# EasyEDA Pro project YTMR4040_3电阻开发板100x100mm_1028打板.eprj, board PCB1
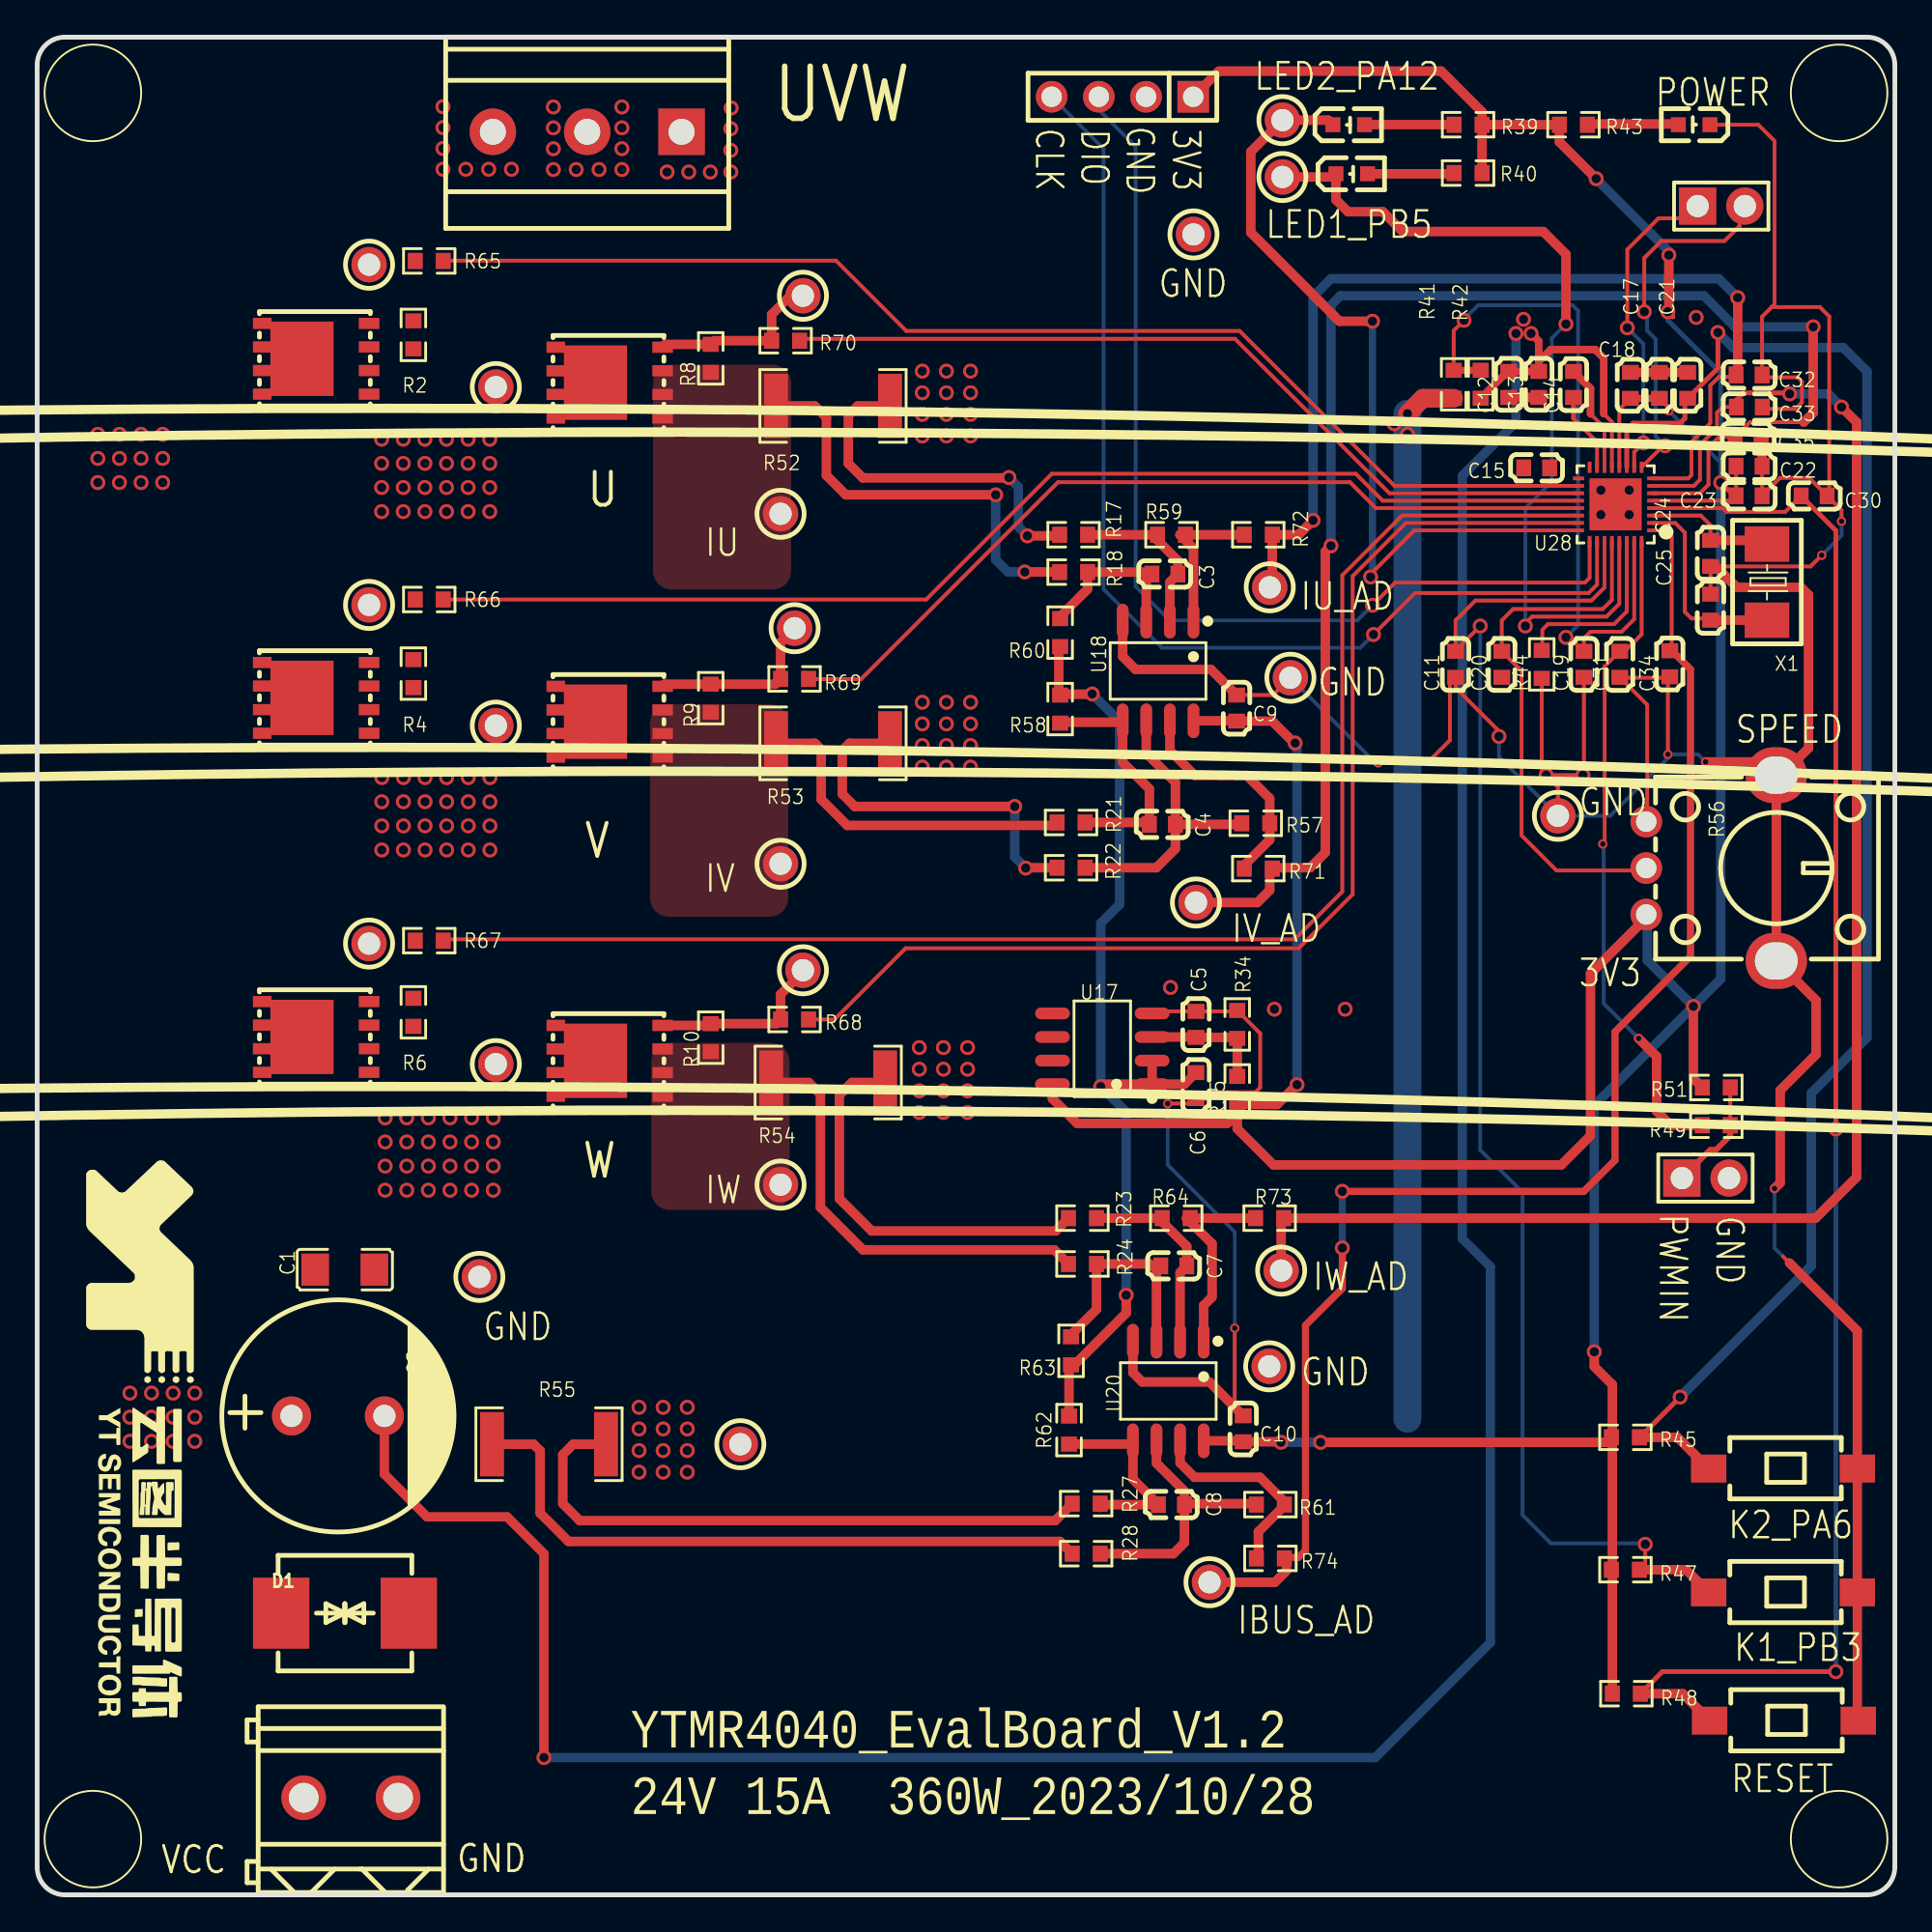
[diagram p1: board, top side]
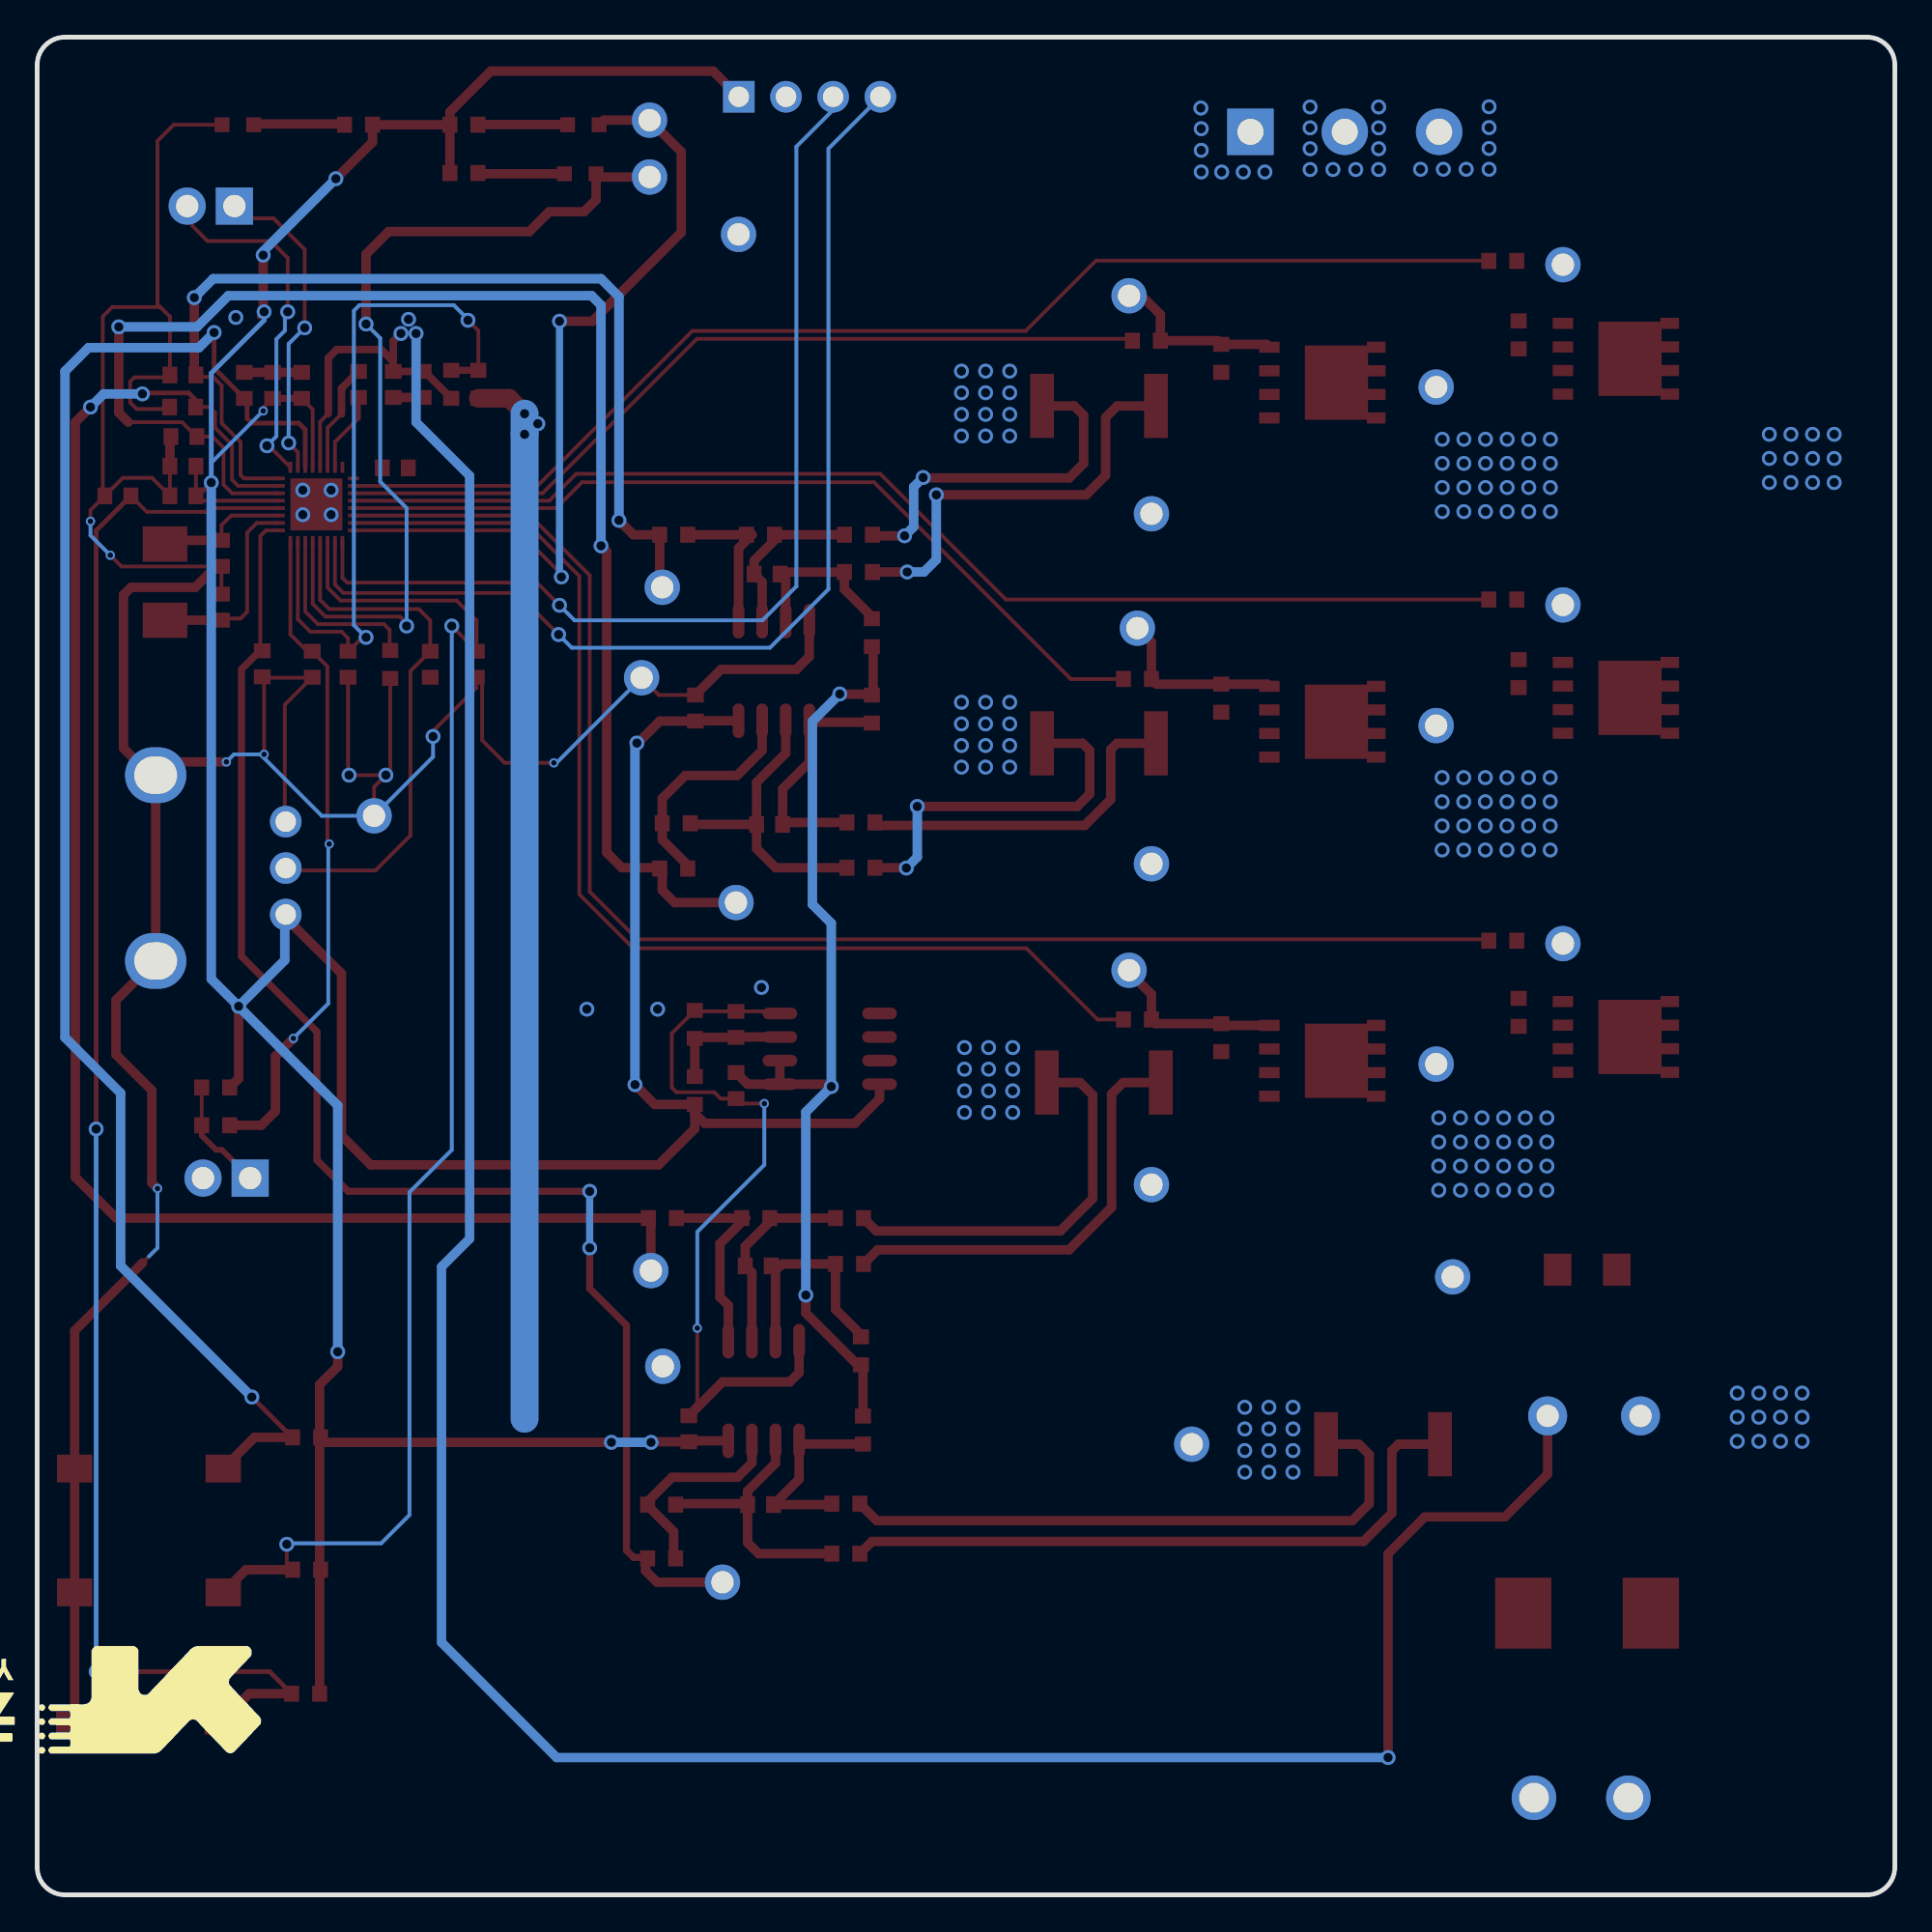
[diagram p2: board, bottom side, seen from below]

Outline 100 x 100 mm; copper layers: Top Layer, Bottom Layer. Coordinates in mm from the lower left corner of the outline.
Outline path: 0,98.5 0,1.5 arc(0.44,0.44) 1.5,0 98.5,0 arc(99.56,0.44) 100,1.5 100,98.5 arc(99.56,99.56) 98.5,100 1.5,100 arc(0.44,99.56) 0,98.5
Stack: Top Layer 0.035mm / Dielectric1 1.51mm FR4 er 4.5 / Bottom Layer 0.035mm

## Design rules (mm)
template: 自定义配置
spacing copperThickness1oz (default): track to track 0.102, other pairs 0.152 to 0.3
spacing copperThickness2oz: track to track 0.203, other pairs 0.152 to 0.3
track width copperThickness1oz (default): min 0.127, default 0.254, max 2.54
track width copperThickness2oz: min 0.203, default 0.254, max 2.54
differential pair differentialPair (default): width min 0.127, default 0.254, max 2.54; gap min 0.152, default 0.152
via viaSize (default): diameter min 0.5, default 0.61, max 10; hole min 0.3, default 0.305, max 6.3

## Placement (name value [footprint] x y rotation side)
C1  100nF  [C1206]  16.56 33.66 0 top
C2  1000uF  [CAP-TH_BD12.5-P5.00-D0.6-FD]  16.19 25.78 0 top
C3  100pF  [C0603]  60.71 71.1 0 top
C4  100pF  [C0603]  60.57 57.62 0 top
C5  100nF  [C0603]  62.38 46.86 90 top
C6  100nF  [C0603]  62.38 43.56 270 top
C7  100pF  [C0603]  61.19 33.86 0 top
C8  100pF  [C0603]  61.06 21.01 0 top
C9  100nF  [C0603]  64.57 63.89 90 top
C10  100nF  [C0603]  64.92 25.09 90 top
C11  100nF  [C0603]  76.36 66.24 90 top
C12  100nF  [C0603]  79.22 81.31 270 top
C13  10uF  [C0603]  80.83 81.31 270 top
C14  100nF  [C0603]  82.7 81.31 90 top
C15  1uF  [C0603]  80.72 76.81 0 top
C17  100nF  [C0603]  87.32 81.25 270 top
C18  10uF  [C0603]  85.76 81.25 270 top
C19  100nF  [C0603]  83.26 66.24 90 top
C20  100nF  [C0603]  78.84 66.24 90 top
C21  100nF  [C0603]  88.85 81.25 270 top
C22  4.7uF  [C0603]  92.15 76.91 180 top
C23  100nF  [C0603]  92.15 75.31 180 top
C24  20pF  [C0603]  90.07 72.21 270 top
C25  20pF  [C0603]  90.08 69.32 90 top
C30  100nF  [C0603]  95.66 75.31 180 top
C31  100pF  [C0603]  85.19 66.24 90 top
C32  15nF  [C0603]  92.15 81.81 180 top
C33  15nF  [C0603]  92.17 80.09 0 top
C34  15nF  [C0603]  87.88 66.27 90 top
C35  15nF  [C0603]  92.1 78.5 180 top
D1  SMCJ30CA  [SMC_L6.9-W5.9-LS7.9-BI]  16.57 15.16 180 top
H1  X6511WV-04H-C60D30  [HDR-TH_4P-P2.54-V-M]  58.42 96.79 180 top
H2  PZ254V-11-02P  [HDR-TH_2P-P2.54-V-M]  90.65 90.91 0 top
H3  PZ254V-11-02P  [HDR-TH_2P-P2.54-V-M]  89.8 38.58 0 top
LED1  KT-0603白灯  [LED0603-R-RD_WHITE]  70.6 95.29 0 top
LED2  KT-0603白灯  [LED0603-R-RD_WHITE]  70.76 92.64 0 top
LED3  KT-0603白灯  [LED0603-R-RD_WHITE]  89.2 95.29 180 top
Q1  VSP003N04MST-G  [DFN-8_L5.8-W4.9-P1.27-LS6.1-BL]  14.99 82.69 90 top
Q2  VSP003N04MST-G  [DFN-8_L5.8-W4.9-P1.27-LS6.1-BL]  14.99 64.44 90 top
Q3  VSP003N04MST-G  [DFN-8_L5.8-W4.9-P1.27-LS6.1-BL]  14.99 46.18 90 top
Q4  VSP003N04MST-G  [DFN-8_L5.8-W4.9-P1.27-LS6.1-BL]  30.79 81.4 90 top
Q5  VSP003N04MST-G  [DFN-8_L5.8-W4.9-P1.27-LS6.1-BL]  30.79 63.15 90 top
Q6  VSP003N04MST-G  [DFN-8_L5.8-W4.9-P1.27-LS6.1-BL]  30.79 44.9 90 top
R2  12kΩ  [R0603]  20.25 83.97 90 top
R4  12kΩ  [R0603]  20.25 65.74 90 top
R6  12kΩ  [R0603]  20.25 47.5 90 top
R8  12kΩ  [R0603]  36.26 82.71 90 top
R9  12kΩ  [R0603]  36.26 64.42 90 top
R10  12kΩ  [R0603]  36.26 46.14 90 top
R17  3kΩ  [R0603]  55.79 73.22 0 top
R18  3kΩ  [R0603]  55.79 71.2 0 top
R21  3kΩ  [R0603]  55.66 57.73 0 top
R22  3kΩ  [R0603]  55.66 55.29 0 top
R23  1kΩ  [R0603]  56.27 36.43 0 top
R24  1kΩ  [R0603]  56.27 33.96 0 top
R27  3kΩ  [R0603]  56.47 21.06 0 top
R28  3kΩ  [R0603]  56.47 18.36 0 top
R34  12kΩ  [R0603]  64.6 46.86 270 top
R35  12kΩ  [R0603]  64.6 43.3 270 top
R39  3kΩ  [R0603]  77.03 95.29 0 top
R40  3kΩ  [R0603]  77.03 92.69 0 top
R41  51kΩ  [R0603]  76.25 81.31 270 top
R42  3kΩ  [R0603]  77.71 81.31 90 top
R43  3kΩ  [R0603]  82.7 95.29 180 top
R44  0Ω  [R0603]  80.99 66.23 270 top
R45  12kΩ  [R0603]  85.5 24.63 180 top
R47  12kΩ  [R0603]  85.5 17.5 180 top
R48  12kΩ  [R0603]  85.55 10.83 180 top
R49  1kΩ  [R0603]  90.39 41.43 180 top
R51  12kΩ  [R0603]  90.39 43.46 180 top
R52  5mΩ  [R2512]  42.84 80.15 180 top
R53  5mΩ  [R2512]  42.84 61.99 180 top
R54  5mΩ  [R2512]  42.58 43.73 180 top
R55  5mΩ  [R2512]  27.55 24.26 0 top
R56  10kΩ  [RES-TH_RK09K1130A70]  90.12 55.27 270 top
R57  24kΩ  [R0603]  65.6 57.68 0 top
R58  24kΩ  [R0603]  55.07 63.83 270 top
R59  24kΩ  [R0603]  61.06 73.22 0 top
R60  24kΩ  [R0603]  55.07 67.94 90 top
R61  24kΩ  [R0603]  66.39 21.01 0 top
R62  24kΩ  [R0603]  55.55 25.02 270 top
R63  24kΩ  [R0603]  55.66 29.29 270 top
R64  24kΩ  [R0603]  61.32 36.43 0 top
R65  4.7Ω  [R0603]  21.11 87.95 180 top
R66  4.7Ω  [R0603]  21.11 69.73 180 top
R67  4.7Ω  [R0603]  21.11 51.36 180 top
R68  4.7Ω  [R0603]  40.77 47.12 180 top
R69  4.7Ω  [R0603]  40.77 65.45 180 top
R70  4.7Ω  [R0603]  40.29 83.66 180 top
R71  100Ω  [R0603]  65.73 55.25 0 top
R72  100Ω  [R0603]  65.73 73.22 0 top
R73  100Ω  [R0603]  66.34 36.43 0 top
R74  100Ω  [R0603]  66.39 18.11 0 top
SW2  TS-1101-C-W  [SW-SMD_L6.0-W3.3-LS8.0]  93.98 22.95 180 top
SW3  TS-1101-C-W  [SW-SMD_L6.0-W3.3-LS8.0]  93.98 16.28 180 top
SW4  TS-1101-C-W  [SW-SMD_L6.0-W3.3-LS8.0]  94.03 9.38 180 top
U1  RH-5000  [TEST-TH_BD2.54-P1.4_RED]  17.87 87.75 0 top
U2  RH-5000  [TEST-TH_BD2.54-P1.4_RED]  17.87 69.44 180 top
U3  RH-5000  [TEST-TH_BD2.54-P1.4_RED]  17.87 51.21 180 top
U4  DB128L-5.08-2P-GN-S  [CONN-TH_2P-P5.08_DB128L-5.08-2P]  16.89 5.23 0 top
U5  RH-5000  [TEST-TH_BD2.54-P1.4_RED]  24.69 81.16 90 top
U6  RH-5000  [TEST-TH_BD2.54-P1.4_RED]  24.69 62.94 90 top
U7  RH-5000  [TEST-TH_BD2.54-P1.4_RED]  24.69 44.72 90 top
U8  RH-5000  [TEST-TH_BD2.54-P1.4_RED]  23.8 33.26 0 top
U9  XY128V-A-5.08-3P  [CONN-TH_XY128V-A-5.08-3P]  29.61 94.91 180 top
U10  RH-5000  [TEST-TH_BD2.54-P1.4_RED]  41.22 86.08 180 top
U11  RH-5000  [TEST-TH_BD2.54-P1.4_RED]  40.02 74.34 0 top
U12  RH-5000  [TEST-TH_BD2.54-P1.4_RED]  40.02 55.5 0 top
U13  RH-5000  [TEST-TH_BD2.54-P1.4_RED]  40.02 38.23 0 top
U14  RH-5000  [TEST-TH_BD2.54-P1.4_RED]  37.85 24.26 0 top
U15  RH-5000  [TEST-TH_BD2.54-P1.4_RED]  40.77 68.18 180 top
U16  RH-5000  [TEST-TH_BD2.54-P1.4_RED]  41.22 49.77 0 top
U17  RS822XK  [SOP-8_L4.9-W3.9-P1.27-LS6.0-BL]  57.34 45.54 90 top
U18  RS822XK  [SOP-8_L4.9-W3.9-P1.27-LS6.0-BL]  60.34 65.88 180 top
U19  RH-5000  [TEST-TH_BD2.54-P1.4_RED]  62.38 53.42 0 top
U20  RS822XK  [SOP-8_L4.9-W3.9-P1.27-LS6.0-BL]  60.89 27.12 180 top
U21  RH-5000  [TEST-TH_BD2.54-P1.4_RED]  66.35 70.39 180 top
U22  RH-5000  [TEST-TH_BD2.54-P1.4_RED]  63.11 16.83 0 top
U23  RH-5000  [TEST-TH_BD2.54-P1.4_RED]  67.46 65.52 0 top
U24  RH-5000  [TEST-TH_BD2.54-P1.4_RED]  66.97 33.6 0 top
U25  RH-5000  [TEST-TH_BD2.54-P1.4_RED]  66.32 28.45 0 top
U26  RH-5000  [TEST-TH_BD2.54-P1.4_RED]  81.86 58.08 0 top
U28  -  [QFN-32_L4.0-W4.0-P0.40-BL-EP2.7]  84.97 74.85 90 top
U29  RH-5000  [TEST-TH_BD2.54-P1.4_RED]  67.03 92.47 0 top
U30  RH-5000  [TEST-TH_BD2.54-P1.4_RED]  67.03 95.53 0 top
U31  RH-5000  [TEST-TH_BD2.54-P1.4_RED]  62.24 89.38 0 top
X1  8MHz  [CRYSTAL-SMD_L5.0-W3.2]  93.12 70.67 90 top

## Footprints (pads in the part's own frame, mm; a bottom-side part is the same pattern mirrored in y, then rotated)
C0603
  rect 0.8x0.9 smd: 1(-0.7,0) 2(0.7,0)
C1206
  rect 1.485x1.728 smd: 1(-1.593,0) 2(1.593,0)
CAP-TH_BD12.5-P5.00-D0.6-FD
  round 2.1 hole 1.2: 1(-2.5,0) 2(2.5,0)
CONN-TH_2P-P5.08_DB128L-5.08-2P
  round 2.4 hole 1.6: 1(-2.54,0) 2(2.54,0)
CONN-TH_XY128V-A-5.08-3P
  rect 2.5x2.5 hole 1.4: 1(-5.08,0)
  round 2.5 hole 1.4: 2(0,0) 3(5.08,0)
CRYSTAL-SMD_L5.0-W3.2
  rect 1.9x2.4 smd: 1(-2.05,0) 2(2.05,0)
DFN-8_L5.8-W4.9-P1.27-LS6.1-BL
  rect 0.6x1.1 smd: 1(-1.905,-2.875) 2(-0.635,-2.875) 3(0.635,-2.875) 4(1.905,-2.875)
  rect 0.6x1 smd: 5(1.905,2.875) 6(0.635,2.875) 7(-0.635,2.875) 8(-1.905,2.875)
  rect 4x3.4 smd: 9(0,0.738)
HDR-TH_2P-P2.54-V-M
  rect 2x2 hole 1.2: 1(-1.27,0)
  round 2 hole 1.2: 2(1.27,0)
HDR-TH_4P-P2.54-V-M
  rect 1.7x1.7 hole 1.1: 1(-3.81,0)
  round 1.7 hole 1.1: 2(-1.27,0) 3(1.27,0) 4(3.81,0)
LED0603-R-RD_WHITE
  rect 0.8x0.8 smd: 1(0.851,0) 2(-0.851,0)
QFN-32_L4.0-W4.0-P0.40-BL-EP2.7
  rect 0.2x0.6 smd: 1(-1.4,-2) 2(-1,-2) 3(-0.6,-2) 4(-0.2,-2) 5(0.2,-2) 6(0.6,-2) 7(1,-2) 8(1.4,-2) 17(1.4,2) 18(1,2) 19(0.6,2) 20(0.2,2) 21(-0.2,2) 22(-0.6,2) 23(-1,2) 24(-1.4,2)
  rect 0.6x0.2 smd: 9(2,-1.4) 10(2,-1) 11(2,-0.6) 12(2,-0.2) 13(2,0.2) 14(2,0.6) 15(2,1) 16(2,1.4) 25(-2,1.4) 26(-2,1) 27(-2,0.6) 28(-2,0.2) 29(-2,-0.2) 30(-2,-0.6) 31(-2,-1) 32(-2,-1.4)
  rect 2.8x2.8 smd: 33(0,0)
R0603
  rect 0.806x0.864 smd: 1(-0.753,0) 2(0.753,0)
R2512
  rect 1.282x3.456 smd: 1(-3.067,0) 2(3.067,0)
RES-TH_RK09K1130A70
  round 1.7 hole 1.1: 1(-2.5,-3.5) 2(0,-3.5) 3(2.5,-3.5)
  oval 3x3.3 hole 2x2.3: 4(5,3.5) 5(-5,3.5)
SMC_L6.9-W5.9-LS7.9-BI
  rect 3.03x3.82 smd: 1(-3.435,0) 2(3.435,0)
SOP-8_L4.9-W3.9-P1.27-LS6.0-BL
  oval 0.63x1.865 smd: 1(-1.905,-2.683) 2(-0.635,-2.683) 3(0.635,-2.683) 4(1.905,-2.683) 5(1.905,2.683) 6(0.635,2.683) 7(-0.635,2.683) 8(-1.905,2.683)
SW-SMD_L6.0-W3.3-LS8.0
  rect 1.9x1.5 smd: 1(-4,0) 2(4,0)
TEST-TH_BD2.54-P1.4_RED
  round 1.9 hole 1.2: 1(0,0)

## Nets
As in the schematic.

Pads without a net: U17 5 6 7

## Via types
v1: diameter 0.8, hole 0.5, Top Layer to Bottom Layer, 231 vias
v2: diameter 0.5, hole 0.3, Top Layer to Bottom Layer, 11 vias

## Routing (per net, layer and track width the routed paths; a pad name or vN(x,y) marks a point on that pad's centre or on a via; arc(x,y) is an arc through that point)
3V3: length 240.7
  Top Layer w0.203: v2(87.83,79.88) 87.83,80.05 87.32,80.56 ; U28.12 85.17,79.96 85.76,80.56 ; U28.5 91.19,75.05 C23.2 C22.2
  Top Layer w0.254: v1(87.78,85.22) 88.05,84.94 ; v1(90.63,76.02) 91.34,75.31 C23.2
  Top Layer w0.381: 85.76,80.56 87.32,80.56
  Top Layer w0.508: R39.2 77.78,95.97 75.58,98.17 63.61,98.17 H1.1 ; R39.2 R40.2 ; R39.2 81.91,95.29 ; v1(66.95,24.36) 66.92,24.39 C10.1 64.87,24.44 U20.8 ; 64.6,42.07 64.6,41.24 66.55,39.29 82.04,39.29 83.62,40.87 83.62,49.59 86.67,52.64 ; 64.6,42.07 R35.2 66.75,42.55 v1(67.82,43.61) ; 64.6,42.07 64.06,41.53 55.98,41.53 54.65,42.86 U17.8 ; v1(83.82,29.24) 83.82,28.44 84.79,27.47 R48.2 ; U18.8 64.55,63.2 C9.1 66.48,63.18 67.67,62 v1(67.72,62) ; R51.2 89.15,43.94 v1(89.15,47.83) ; v1(87.83,88.27) 87.83,85.27 v1(87.78,85.22) ; R43.2 81.95,94.36 v1(83.92,92.38) ; R45.2 84.47,24.36 v1(69.09,24.36)
  Bottom Layer w0.203: v2(87.83,79.88) 90.63,77.09
  Bottom Layer w0.254: v1(87.78,85.22) 87.78,84.76 90.63,81.92 v1(90.63,76.02)
  Bottom Layer w0.508: v1(83.82,29.24) 83.82,42.49 v1(89.15,47.83) ; 86.67,52.64 86.67,50.31 v1(89.15,47.83) ; v1(67.82,43.61) 67.82,61.9 v1(67.72,62) ; v1(87.83,88.27) 87.83,88.47 v1(83.92,92.38) ; v1(89.15,47.83) 90.63,49.3 v1(90.63,76.02) ; v1(69.09,24.36) v1(66.95,24.36)
AGND: length 451.7
  Top Layer w0.203: C22.1 C23.1 93.82,76.28 95.39,76.28 C30.1 ; v2(96.06,72.11) 95.46,71.51 90.08,71.51 ; v2(97.13,73.94) 97.13,74.53 C30.1 ; U26.1 81.86,59.64 v1(81.23,60.27) ; C30.1 96.47,75.42 96.47,84.96 95.96,85.47 93.37,85.47 ; 93.98,34.37 94.32,34.02 ; 86.67,57.64 86.67,64.06 C31.1 ; 92.85,80.09 92.96,79.98 94.64,79.98 95,80.34 95,81.46 94.77,81.69 92.85,81.69 92.85,84.95 93.37,85.47 ; 87.95,65.52 87.78,65.34 v2(87.78,61.39) ; 87.95,65.52 88.01,65.57 ; 87.95,65.52 85.63,65.52 ; U17.4 60.13,47.56 C5.2 64.55,47.56 64.6,47.61 65.84,46.37 65.84,43.46 65.58,43.21 63.55,43.21 63.21,42.86 C6.2 62.11,42.6 v2(60.86,42.6) ; v1(78.69,62.36) 78.69,62.64 76.36,64.98 76.36,65.57 76.05,65.26 76.05,62.15 74.83,60.94 v2(72.19,60.94) ; 93.37,85.47 93.52,85.62 93.52,94.41 92.65,95.29 LED3.2 ; U23.1 66.53,64.58 64.57,64.58 ; 90.08,71.51 C25.2 ; 90.08,71.51 C24.2 ; v1(81.23,60.27) 80.99,60.51 80.99,65.46 ; v1(81.23,60.27) v1(83.21,60.27) 83.26,60.33 83.26,65.52 ; 84.33,79.73 84.77,79.29 U28.13 ; v2(64.47,30.51) 64.47,26.25
  Top Layer w0.406: 80.83,82.53 80.83,83.64 v1(80.42,84.05) ; 80.83,82.53 C13.1 C12.1 79.15,82.01 R42.1 ; 80.83,82.53 81.48,83.19 83.87,83.19 84.33,82.73 84.33,79.73
  Top Layer w0.5: C18.1 C17.1 C21.1 ; C2.2 18.69,22.65 20.99,20.35 25.3,20.35 27.28,18.36 v1(27.28,7.39) ; 94.32,34.02 97.98,30.37 SW2.1 SW3.1 97.98,9.43 SW4.1
  Top Layer w0.508: 93.62,60.09 93.67,60.04 95.35,61.72 95.35,69.98 94.94,70.38 91.49,70.38 90.37,71.51 ; 93.62,60.09 92.73,60.99 v2(89.81,60.99) ; 93.62,60.09 R56.4 ; 93.62,60.09 R56.5 ; R28.1 55.05,19.03 28.6,19.03 27.08,20.55 27.08,23.9 26.72,24.26 24.47,24.26 ; 64.57,64.58 63.19,65.96 59.13,65.96 58.43,66.66 U18.4 ; C22.1 92.85,78.5 ; 93.67,50.24 95.76,48.16 95.76,45.24 93.83,43.31 93.83,38.33 v2(93.52,38.02) ; C10.2 64.47,26.25 63.1,27.61 59.49,27.61 58.98,28.11 U20.4
  Bottom Layer w0.203: v2(96.06,72.11) 97.13,73.18 v2(97.13,73.94) ; v1(78.69,62.36) 78.69,61.26 U26.1 84.68,58.08 87.78,61.19 ; v2(89.81,60.99) 89.41,61.39 v2(87.78,61.39) ; v2(60.86,42.6) 60.86,39.29 64.47,35.69 v2(64.47,30.51) ; U23.1 72.04,60.94 v2(72.19,60.94) ; 93.98,34.37 93.52,34.82 v2(93.52,38.02)
  Bottom Layer w0.5: v1(27.28,7.39) 72.03,7.39 78.23,13.59 78.23,33.81 76.72,35.32 76.72,76.39 79.6,79.27 v1(79.6,84.05)
  vias: v1(61.01,48.84) v1(66.6,47.68) v1(70.41,47.68) v1(80.01,84.81) v1(84.18,75.62) v1(84.18,74.3) v1(85.7,75.62) v1(85.7,74.3) v1(89.31,84.91)
VBUS: length 58.5
  Top Layer w0.508: C12.2 C13.2
  Top Layer w1: R41.2 74.59,80.56 v1(73.76,79.73)
  Bottom Layer w1.5: v1(73.76,79.73) v1(73.76,78.62) 73.76,25.63
  vias: v1(3.27,78.62) v1(3.27,77.32) v1(3.27,76.03) v1(4.43,78.62) v1(4.43,77.32) v1(4.43,76.03) v1(4.99,27.01) v1(4.99,25.71) v1(4.99,24.41) v1(5.59,78.62) v1(5.59,77.32) v1(5.59,76.03) v1(6.16,27.01) v1(6.16,25.71) v1(6.16,24.41) v1(6.76,78.62) v1(6.76,77.32) v1(6.76,76.03) v1(7.32,27.01) v1(7.32,25.71) v1(7.32,24.41) v1(8.48,27.01) v1(8.48,25.71) v1(8.48,24.41) v1(73.05,79.19)
DC_AD: length 38.2
  Top Layer w0.203: v1(82.3,67.69) 82.49,67.69 83.26,66.92 83.26,67.64 83.62,68 85.29,68 85.97,68.67 U28.31 ; v1(76.81,84.76) 76.25,84.2 76.25,82.07
  Top Layer w0.381: 77.71,82.07 76.25,82.07
  Bottom Layer w0.203: v1(76.81,84.76) 76.81,84.81 77.57,85.57 82.65,85.57 82.95,85.27 82.95,68.34 v1(82.3,67.69)
HO1: length 66.1
  Top Layer w0.203: U28.18 73.07,75.85 64.73,84.18 46.79,84.18 43,87.97 21.88,87.97 R65.1
HO2: length 64.5
  Top Layer w0.203: U28.20 72.43,75.05 70.98,76.5 54.62,76.5 47.85,69.73 R66.1
HO3: length 80.6
  Top Layer w0.203: R67.1 21.93,51.44 67.69,51.44 70.26,54 70.26,71.03 73.47,74.25 U28.22
IBUS+: length 94.2
  Top Layer w0.508: R23.1 54.83,35.74 44.92,35.74 43.18,37.48 43.18,43.05 43.85,43.73 45.65,43.73 ; R17.1 54.98,73.16 v1(53.31,73.16) ; R22.1 53.23,55.29 v1(53.21,55.27) ; R52.1 44.17,80.15 43.67,79.64 43.67,77.05 44.44,76.27 52.29,76.27 v1(52.31,76.3) ; R53.1 43.72,61.99 43.34,61.6 43.34,59.26 44.01,58.59 v1(52.62,58.59) ; 30.6,24.26 28.86,24.26 28.3,23.7 28.3,21.06 29.21,20.14 54.8,20.14 R27.1
  Bottom Layer w0.508: v1(53.21,55.27) 52.62,55.86 v1(52.62,58.59) ; v1(53.31,73.16) 52.82,73.65 52.82,75.79 v1(52.31,76.3)
  vias: v1(32.4,26.24) v1(32.4,25.08) v1(32.4,23.92) v1(32.4,22.75) v1(33.7,26.24) v1(33.7,25.08) v1(33.7,23.92) v1(33.7,22.75) v1(35,26.24) v1(35,25.08) v1(35,23.92) v1(35,22.75) v1(47.49,45.61) v1(47.49,44.44) v1(47.49,43.28) v1(47.49,42.12) v1(47.65,82.02) v1(47.65,80.86) v1(47.65,79.69) v1(47.65,78.53) v1(47.65,64.2) v1(47.65,63.03) v1(47.65,61.87) v1(47.65,60.71) v1(48.78,45.61) v1(48.78,44.44) v1(48.78,43.28) v1(48.78,42.12) v1(48.95,82.02) v1(48.95,80.86) v1(48.95,79.69) v1(48.95,78.53) v1(48.95,64.2) v1(48.95,63.03) v1(48.95,61.87) v1(48.95,60.71) v1(50.08,45.61) v1(50.08,44.44) v1(50.08,43.28) v1(50.08,42.12) v1(50.24,82.02) v1(50.24,80.86) v1(50.24,79.69) v1(50.24,78.53) v1(50.24,64.2) v1(50.24,63.03) v1(50.24,61.87) v1(50.24,60.71)
IBUS_AD: length 78.7
  Top Layer w0.203: 87.99,66.99 87.99,73.15 87.68,73.45 U28.1 ; 88.04,67 88.01,66.97
  Top Layer w0.381: v1(70.26,34.82) 70.26,32.64 68.28,30.66 68.28,18.54 67.89,18.16 67.24,18.16 ; v1(70.26,37.87) 83.26,37.87 84.94,39.55 84.94,46.46 89,50.52 89,65.97 88.01,66.97 87.99,66.99
  Top Layer w0.508: 67.24,18.16 67.24,17.44 66.63,16.83 U22.1
  Bottom Layer w0.381: v1(70.26,37.87) v1(70.26,34.82)
IU+: length 22.8
  Top Layer w0.508: R18.1 55.03,71.21 v1(53.16,71.21) ; v1(51.6,75.36) 43.53,75.36 42.49,76.41 42.49,79.52 41.86,80.15 R52.2
  Bottom Layer w0.508: v1(51.6,75.36) 51.6,71.88 52.26,71.21 v1(53.16,71.21)
IU_AD: length 54.4
  Top Layer w0.203: U28.8 88.87,76.25 89.05,76.43 89.05,78.21 90.07,79.22 90.07,81.25 90.53,81.71 91.43,81.71 91.45,81.69
  Top Layer w0.508: 91.45,81.69 91.54,81.78 v1(91.54,85.98) ; U21.1 66.49,70.52 R72.2 67.91,73.22 v1(68.68,73.99)
  Bottom Layer w0.508: v1(68.68,73.99) 68.68,86.03 69.65,87 90.53,87 v1(91.54,85.98)
IV+: length 18.6
  Top Layer w0.508: R53.2 41.87,61.99 42.21,61.65 42.21,58.97 43.61,57.57 54.74,57.57 R21.1
IV_AD: length 81.5
  Top Layer w0.203: U28.6 89.51,75.45 89.97,75.91 89.97,77.9 90.56,78.5 91.45,78.5 91.45,78.52 92.2,79.27 95.1,79.27
  Top Layer w0.508: U19.1 65.68,53.42 66.35,54.08 66.35,55.29 68.52,55.29 69.34,56.11 69.34,72.31 v1(69.65,72.62) ; 95.1,79.27 95.61,79.78 v1(95.61,84.4)
  Bottom Layer w0.508: v1(69.65,72.62) 69.65,85.57 70.16,86.08 89.71,86.08 91.39,84.4 v1(95.61,84.4)
IW+: length 23.6
  Top Layer w0.508: R54.2 41.54,43.73 42.16,43.1 42.16,37.01 44.45,34.72 54.76,34.72 R24.1
IW_AD: length 90.9
  Top Layer w0.203: 91.45,80 91.45,80.09 90.74,80.09 90.42,79.78 90.42,78.97 89.51,78.05 89.51,76.17 89.18,75.85 U28.7
  Top Layer w0.254: 91.45,80.09 91.45,80.45 91.85,80.85 94.28,80.85 v1(94.34,80.8)
  Top Layer w0.508: v1(97.13,80.09) 97.94,79.27 97.94,38.63 95.74,36.43 66.97,36.43 U24.1
  Bottom Layer w0.508: v1(97.13,80.09) 96.42,80.8 v1(94.34,80.8)
KEY1: length 76.5
  Top Layer w0.203: U28.27 84.37,70.37 83.67,69.67 77.42,69.67 76.35,68.61 76.35,66.97 ; 76.35,66.97 v1(77.68,68.3) ; 76.35,66.97 76.36,66.97 ; R47.1 86.56,17.81 v1(86.56,18.87)
  Top Layer w0.508: R47.1 88.76,17.5 SW3.2
  Bottom Layer w0.203: v1(86.56,18.87) 86.51,18.92 81.48,18.92 79.96,20.45 79.96,37.82 77.68,40.1 v1(77.68,68.3)
KEY2: length 86.2
  Top Layer w0.254: U28.11 85.57,78.87 85.92,79.22 88.44,79.22 88.7,79.48 88.7,80.25 ; 88.85,80.56 90.47,82.18 v1(90.47,84.1) ; v1(88.44,26.8) 86.28,24.63
  Top Layer w0.508: R45.1 88.3,24.63 SW2.2
  Bottom Layer w0.508: v1(88.44,26.8) 95.5,33.86 95.5,43.16 98.5,46.15 98.5,82.02 97.23,83.29 91.29,83.29 v1(90.47,84.1)
LED1: length 47.9
  Top Layer w0.203: v1(80.11,68.3) 80.11,68.45 80.47,68.81 84.48,68.81 85.17,69.5 U28.29
  Top Layer w0.508: U29.1 69.74,92.47 LED2.2 69.91,91.25 70.56,90.6 72.44,90.6 73.51,89.53 81.08,89.53 82.3,88.32 v1(82.3,84.56)
  Bottom Layer w0.203: v1(80.11,68.3) 80.11,74.65 81.53,76.07 81.53,83.8 v1(82.3,84.56)
LED2: length 44.2
  Top Layer w0.203: U28.24 74.13,73.45 71.78,71.09 v1(71.78,70.94)
  Top Layer w0.508: LED1.2 69.5,95.53 U30.1 65.33,93.83 65.33,89.48 70.1,84.71 v1(71.88,84.71)
  Bottom Layer w0.381: v1(71.78,70.94) 71.88,71.04 v1(71.88,84.71)
LO1: length 45.4
  Top Layer w0.203: U28.19 72.8,75.45 64.48,83.76 41.15,83.76 R70.1
LO2: length 46.8
  Top Layer w0.203: 41.32,65.79 41.66,65.44 44.35,65.44 54.95,76.04 70.67,76.04 72.06,74.65 U28.21
LO3: length 62.5
  Top Layer w0.203: U28.23 73.68,73.85 70.81,70.99 70.81,53.86 67.91,50.96 46.75,50.96 42.92,47.12 R68.1
NRST: length 87.8
  Top Layer w0.203: U28.4 90.73,74.65 90.93,74.45 94.1,74.45 C30.2
  Top Layer w0.254: C30.2 96.82,73.44 v1(96.82,41.22) ; R48.1 87.49,12.01 v1(96.82,12.01)
  Top Layer w0.508: R48.1 88.58,10.83 SW4.2
  Bottom Layer w0.254: v1(96.82,12.01) v1(96.82,41.22)
PWMIN: length 35.7
  Top Layer w0.203: v2(84.28,56.57) 84.38,56.67 84.38,66.13 C31.2 85.46,66.94 86.37,67.85 U28.32
  Top Layer w0.508: R49.2 87.94,41.43 87.17,42.19 87.17,45.14 v2(86.21,46.1)
  Bottom Layer w0.203: v2(84.28,56.57) 84.33,56.52 84.33,47.98 v2(86.21,46.1)
SPEED: length 29.1
  Top Layer w0.203: 86.67,55.14 81.79,55.14 79.91,57.02 79.91,65.88 C20.2 78.84,68.61 79.45,69.22 84.28,69.22 84.77,69.71 U28.28
SWCLK: length 59.3
  Top Layer w0.203: U28.26 83.97,70.53 83.51,70.08 74.17,70.08 v1(71.93,67.84)
  Bottom Layer w0.203: H1.4 57.4,94 57.4,70.28 60.55,67.13 71.22,67.13 v1(71.93,67.84)
SWDIO: length 55.3
  Top Layer w0.203: v1(71.88,69.42) 73.1,70.64 83.31,70.64 83.57,70.89 U28.25
  Bottom Layer w0.203: H1.3 57.15,96.09 59.13,94.11 59.13,70.43 60.96,68.61 71.07,68.61 v1(71.88,69.42)
U:
  vias: v1(18.54,78.36) v1(18.54,77.06) v1(18.54,75.76) v1(18.54,74.46) v1(19.71,78.36) v1(19.71,77.06) v1(19.71,75.76) v1(19.71,74.46) v1(20.87,78.36) v1(20.87,77.06) v1(20.87,75.76) v1(20.87,74.46) v1(21.84,96.25) v1(21.84,95.13) v1(21.84,94.01) v1(21.84,92.89) v1(22.04,78.36) v1(22.04,77.06) v1(22.04,75.76) v1(22.04,74.46) v1(23.07,92.89) v1(23.2,78.36) v1(23.2,77.06) v1(23.2,75.76) v1(23.2,74.46) v1(24.3,92.89) v1(24.36,78.36) v1(24.36,77.06) v1(24.36,75.76) v1(24.36,74.46) v1(25.53,92.89)
U1_RX: length 17
  Top Layer w0.203: v1(86.46,78.16) 85.97,77.66 U28.10 ; v1(85.6,84.35) 85.6,88.57 87.27,90.25 88.72,90.25 H2.1
  Bottom Layer w0.203: v1(85.6,84.35) 86.46,83.49 v1(86.46,78.16)
U1_TX: length 19.3
  Top Layer w0.203: H2.2 91.64,90.63 91.64,89.84 90.83,89.03 87.43,89.03 86.51,88.11 v1(86.51,85.22) ; v1(87.63,78) 87.52,78 U28.9
  Bottom Layer w0.203: v1(86.51,85.22) 86.66,85.06 86.66,84.2 87.12,83.74 87.12,78.51 v1(87.63,78)
V:
  vias: v1(18.55,60.14) v1(18.55,58.84) v1(18.55,57.54) v1(18.55,56.25) v1(19.72,60.14) v1(19.72,58.84) v1(19.72,57.54) v1(19.72,56.25) v1(20.88,60.14) v1(20.88,58.84) v1(20.88,57.54) v1(20.88,56.25) v1(22.04,60.14) v1(22.04,58.84) v1(22.04,57.54) v1(22.04,56.25) v1(23.21,60.14) v1(23.21,58.84) v1(23.21,57.54) v1(23.21,56.25) v1(24.37,60.14) v1(24.37,58.84) v1(24.37,57.54) v1(24.37,56.25) v1(27.79,96.24) v1(27.79,95.12) v1(27.79,93.99) v1(27.79,92.87) v1(29.02,92.87) v1(30.25,92.87) v1(31.48,96.24) v1(31.48,95.12) v1(31.48,94) v1(31.48,92.87)
VREF: length 53
  Top Layer w0.508: v1(58.62,32.28) 58.62,31.32 55.84,28.54 55.55,28.54 R62.1 ; v1(56.79,64.64) 56.78,64.63 55,64.63 55,67.23 ; U17.1 57.38,43.64 v1(57.25,43.51) ; U17.1 61.75,43.64 62.38,44.26 ; U17.1 U17.2
  Bottom Layer w0.508: v1(56.79,64.64) 58.27,63.17 58.27,53.31 57.25,52.3 v1(57.25,43.51) 58.62,42.14 v1(58.62,32.28)
W:
  vias: v1(18.73,41.83) v1(18.73,40.53) v1(18.73,39.23) v1(18.73,37.93) v1(19.9,41.83) v1(19.9,40.53) v1(19.9,39.23) v1(19.9,37.93) v1(21.06,41.83) v1(21.06,40.53) v1(21.06,39.23) v1(21.06,37.93) v1(22.22,41.83) v1(22.22,40.53) v1(22.22,39.23) v1(22.22,37.93) v1(23.39,41.83) v1(23.39,40.53) v1(23.39,39.23) v1(23.39,37.93) v1(24.55,41.83) v1(24.55,40.53) v1(24.55,39.23) v1(24.55,37.93) v1(33.91,92.74) v1(35.07,92.74) v1(36.24,92.74) v1(37.34,95.07) v1(37.34,93.91) v1(37.34,92.75) v1(37.36,96.18)
$1N3568: length 8.8
  Top Layer w0.508: Q4.4 33.83,83.46 R8.2 36.45,83.66 R70.2 39.54,85.07 40.54,86.08
$1N4481: length 9.6
  Top Layer w0.508: U15.1 40.02,67.43 R69.2 39.73,65.17 R9.2 33.78,65.17 Q5.4
$1N4773: length 9.4
  Top Layer w0.508: 40.77,49.77 40.77,49.23 40.02,48.47 R68.2 39.79,46.9 R10.2 36.17,46.8 Q6.4
$1N49414: length 11.8
  Top Layer w0.508: 60.05,33.81 59.89,33.96 R24.2 57.02,31.52 55.55,30.04 ; U20.3 60.25,33.63 C7.1
$1N49682: length 11
  Top Layer w0.508: U20.1 62.79,31.73 63.25,32.18 63.25,35.05 61.87,36.43 65.46,36.43
$1N49683: length 10.7
  Top Layer w0.508: R23.2 60.36,36.43 61.88,34.9 C7.2 61.52,33.5 U20.2
$1N50367: length 9.3
  Top Layer w0.508: 55,68.73 56.55,70.28 R18.2 59.9,71.2 C3.1 59.7,70.8 U18.3
$1N50382: length 8.4
  Top Layer w0.508: R72.1 61.52,73.22 62.24,72.49 U18.1
$1N50386: length 8.9
  Top Layer w0.508: R17.2 60.01,73.22 61.41,71.82 61.41,71.1 60.97,70.67 U18.2
$1N50869: length 13
  Top Layer w0.508: U18.5 58.43,60.97 59.87,59.53 C4.1 59.77,57.73 R21.2 ; 55,63.12 58.36,63.12
$1N50885: length 12.4
  Top Layer w0.508: U18.7 60.97,61.6 62.32,60.26 65.11,60.26 66.35,59.02 66.35,56.8 64.84,55.29
$1N50889: length 16.4
  Top Layer w0.508: C4.2 61.27,59.89 59.7,61.45 U18.6 ; C4.2 64.74,57.62 64.84,57.73 ; C4.2 61.27,56.32 60.25,55.29 R22.2
$1N51493: length 6.1
  Top Layer w0.203: R51.1 R49.1
  Top Layer w0.305: H3.1 90.06,40.11 90.37,40.11 91.14,40.88 R49.1
$1N52636: length 9.9
  Top Layer w0.203: U28.30 85.57,69.08 84.89,68.4 81.33,68.4 81.03,68.1 81.03,67 80.99,66.96
$1N52663: length 5.8
  Top Layer w0.203: 83.62,79.72 84.37,78.97 U28.14
  Top Layer w0.406: C14.2 83.62,81.09 83.62,79.72
$1N52664: length 4.3
  Top Layer w0.203: 82.7,79.48 83.97,78.21 U28.15
  Top Layer w0.254: 82.7,79.48 C14.1
$1N52684: length 7.3
  Top Layer w0.203: C24.1 90.07,73.73 89.56,74.25 U28.3
  Top Layer w0.508: X1.2 92.92,72.91 C24.1
$1N52686: length 10.8
  Top Layer w0.203: C25.1 89.99,68.71 89.05,68.71 88.7,69.06 88.7,73.33 88.18,73.85 U28.2
  Top Layer w0.508: X1.1 93.11,68.62 C25.1
$1N52714: length 4.7
  Top Layer w0.508: LED2.1 76.23,92.64 R40.1
$1N56722: length 4.9
  Top Layer w0.508: 88.35,95.28 88.29,95.33 83.45,95.33
$1N56854: length 4.8
  Top Layer w0.508: 71.45,95.3 76.23,95.3 76.27,95.25
$1N57631: length 6.4
  Top Layer w0.508: R35.1 R34.2 64.54,46.16 C5.1 ; U17.3 62.18,46.18
$1N57781: length 10.7
  Top Layer w0.508: R62.2 58.81,24.27 U20.5 58.98,22.38 C8.1 57.37,21.01 57.22,20.85
$1N57838: length 11.3
  Top Layer w0.508: 65.74,18.16 65.74,19.55 67.24,21.06 65.82,22.48 62.3,22.48 61.52,23.25 U20.7
$1N57839: length 14.9
  Top Layer w0.508: C8.2 61.76,21.73 60.25,23.24 U20.6 ; C8.2 61.76,18.96 61.16,18.36 R28.2 ; C8.2 61.81,21.06 65.74,21.06

## Copper pours and planes (outline as drawn; the poured copper is in the pictures)
3V3 on Top Layer: 61.25,98.08 63.64,98.08 63.64,95.54 61.25,95.54
3V3 on Bottom Layer: 61.25,98.08 63.64,98.08 63.64,95.54 61.25,95.54
AGND on Top Layer: 84.95,93.29 84.96,93.47 85.02,93.66 85.11,93.84 85.24,94 85.4,94.13 85.58,94.22 85.77,94.28 85.95,94.29 99.74,94.29 99.91,94.28 100.11,94.22 100.29,94.13 100.44,94 100.57,93.84 100.67,93.66 100.72,93.47 100.74,93.29 100.74,68.79 100.72,68.62 100.67,68.42 100.57,68.24 100.44,68.09 100.29,67.96 100.11,67.86 99.91,67.81 99.74,67.79 85.95,67.79 85.77,67.81 85.58,67.86 85.4,67.96 85.24,68.09 85.11,68.24 85.02,68.42 84.96,68.62 84.95,68.79
AGND on Top Layer: 57.56,74.46 57.57,74.64 57.63,74.83 57.72,75.01 57.85,75.17 58.01,75.3 58.19,75.39 58.38,75.45 58.56,75.46 101.46,75.46 101.64,75.45 101.83,75.39 102.01,75.3 102.17,75.17 102.3,75.01 102.39,74.83 102.45,74.64 102.46,74.46 102.46,5.95 102.45,5.78 102.39,5.58 102.3,5.4 102.17,5.25 102.01,5.12 101.83,5.02 101.64,4.97 101.46,4.95 58.56,4.95 58.38,4.97 58.19,5.02 58.01,5.12 57.85,5.25 57.72,5.4 57.63,5.58 57.57,5.78 57.56,5.95
AGND on Top Layer: 49.9,107.52 49.91,107.69 49.97,107.89 50.06,108.07 50.19,108.22 50.35,108.35 50.53,108.44 50.72,108.5 50.9,108.52 104.16,108.52 104.33,108.5 104.53,108.44 104.71,108.35 104.86,108.22 104.99,108.07 105.08,107.89 105.14,107.69 105.16,107.52 105.16,86.27 105.14,86.09 105.08,85.9 104.99,85.72 104.86,85.56 104.71,85.43 104.53,85.34 104.33,85.28 104.16,85.27 50.9,85.27 50.72,85.28 50.53,85.34 50.35,85.43 50.19,85.56 50.06,85.72 49.97,85.9 49.91,86.09 49.9,86.27
AGND on Top Layer: 78.89,84.77 78.9,84.87 78.95,85.01 79.04,85.12 79.15,85.21 79.29,85.26 79.39,85.27 80.58,85.27 80.68,85.26 80.82,85.21 80.93,85.12 81.02,85.01 81.07,84.87 81.08,84.77 81.08,83.94 81.07,83.83 81.02,83.7 80.93,83.59 80.82,83.5 80.68,83.45 80.58,83.44 79.39,83.44 79.29,83.45 79.15,83.5 79.04,83.59 78.95,83.7 78.9,83.83 78.89,83.94
AGND on Top Layer: 17.51,34.46 17.52,34.64 17.58,34.83 17.67,35.01 17.8,35.17 17.96,35.3 18.14,35.39 18.33,35.45 18.51,35.46 24.51,35.46 24.69,35.45 24.88,35.39 25.06,35.3 25.22,35.17 25.34,35.01 25.44,34.83 25.49,34.64 25.51,34.46 25.51,4.88 25.49,4.71 25.44,4.51 25.34,4.33 25.22,4.18 25.06,4.05 24.88,3.96 24.69,3.9 24.51,3.88 18.51,3.88 18.33,3.9 18.14,3.96 17.96,4.05 17.8,4.18 17.67,4.33 17.58,4.51 17.52,4.71 17.51,4.88
AGND on Top Layer: 58.63,98.08 61.02,98.08 61.02,95.54 58.63,95.54
AGND on Bottom Layer: 78.64,85.37 81.22,85.37 81.22,83.44 78.64,83.44
AGND on Bottom Layer: 57,75.78 57.01,75.96 57.07,76.16 57.16,76.33 57.29,76.49 57.45,76.62 57.63,76.71 57.82,76.77 58,76.78 105.83,76.78 106.01,76.77 106.2,76.71 106.38,76.62 106.54,76.49 106.67,76.33 106.76,76.16 106.82,75.96 106.83,75.78 106.83,1.94 106.82,1.76 106.76,1.57 106.67,1.39 106.54,1.23 106.38,1.11 106.2,1.01 106.01,0.96 105.83,0.94 58,0.94 57.82,0.96 57.63,1.01 57.45,1.11 57.29,1.23 57.16,1.39 57.07,1.57 57.01,1.76 57,1.94
AGND on Bottom Layer: 58.63,98.08 61.02,98.08 61.02,95.54 58.63,95.54
VBUS on Top Layer: 83.67,76.55 83.67,77.73 82.24,79.17 81.23,79.17 81.23,81.01 80.35,81.01 80.35,80.2 80.37,80.19 80.37,79.43 79.55,78.61 79.55,76.43 79.6,76.38 80.46,76.38 80.46,77.87 80.75,78.16 82.4,78.16 83.26,77.29 83.26,76.76 83.47,76.55
VBUS on Top Layer: 0.86,98.25 0.88,98.42 0.93,98.62 1.03,98.8 1.15,98.95 1.31,99.08 1.49,99.18 1.69,99.23 1.86,99.25 14.73,99.25 14.91,99.23 15.1,99.18 15.28,99.08 15.44,98.95 15.56,98.8 15.66,98.62 15.71,98.42 15.73,98.25 15.73,2.2 15.71,2.02 15.66,1.83 15.56,1.65 15.44,1.49 15.28,1.36 15.1,1.27 14.91,1.21 14.73,1.2 1.86,1.2 1.69,1.21 1.49,1.27 1.31,1.36 1.15,1.49 1.03,1.65 0.93,1.83 0.88,2.02 0.86,2.2
VBUS on Top Layer: 76.7,80.24 76.7,79.79 76.96,79.53 78.59,79.53 78.79,79.73 78.79,81.01 79.74,81.01 79.81,80.95 79.81,79.53 78.94,78.66 76.35,78.66 75.69,79.32 75.69,79.93 76.3,80.54 76.3,80.56 76.62,80.24
VBUS on Top Layer: 75.64,80.89 75.73,80.98 76.7,80.98 76.7,79.93 75.74,80.89
VBUS on Bottom Layer: 70.49,9 70.04,8.9 69.59,8.87 69.36,8.88 69.34,8.88 69.34,8.9 69.34,8.91 55.13,8.91 55.05,8.93 54.96,8.97 24.62,8.97 24.53,8.94 10.33,8.94 10.33,8.93 10.33,8.92 10.31,8.92 10.08,8.91 9.63,8.94 9.19,9.03 4.66,13.31 4.07,13.91 3.86,14.72 3.87,14.87 3.89,15.01 3.89,26.73 4.18,27.44 4.89,27.73 8.82,27.73 9.53,27.44 9.82,26.73 9.82,16.78 12.28,14.32 24.53,14.32 24.61,14.32 24.68,14.3 64.21,14.3 64.21,14.29 67.39,14.29 69.85,16.75 69.85,26.69 70.14,27.4 70.85,27.69 74.78,27.69 74.82,27.69 75.61,27.41 76.04,26.69 76.04,14.98 76.04,14.93 75.76,13.96 75.01,13.28
VBUS on Bottom Layer: -29.88,12.4 -29.86,12.4 -29.85,12.4
VBUS on Bottom Layer: 1.32,93.37 1.33,93.55 1.39,93.74 1.48,93.92 1.61,94.08 1.77,94.21 1.95,94.3 2.14,94.35 2.32,94.37 9.04,94.37 9.22,94.35 9.41,94.3 9.59,94.21 9.75,94.08 9.88,93.92 9.97,93.74 10.02,93.55 10.04,93.37 10.04,24.3 10.02,24.12 9.97,23.93 9.88,23.75 9.75,23.59 9.59,23.46 9.41,23.37 9.22,23.31 9.04,23.3 2.32,23.3 2.14,23.31 1.95,23.37 1.77,23.46 1.61,23.59 1.48,23.75 1.39,23.93 1.33,24.12 1.32,24.3
IBUS+ on Top Layer: 29.97,26.29 29.98,26.39 30.03,26.53 30.12,26.64 30.23,26.72 30.37,26.77 30.47,26.79 35.47,26.79 35.58,26.77 35.71,26.72 35.83,26.64 35.91,26.53 35.96,26.39 35.97,26.29 35.97,22.29 35.96,22.18 35.91,22.05 35.83,21.93 35.71,21.85 35.58,21.8 35.47,21.79 30.47,21.79 30.37,21.8 30.23,21.85 30.12,21.93 30.03,22.05 29.98,22.18 29.97,22.29
IBUS+ on Top Layer: 45.14,64.89 45.15,65.06 45.21,65.26 45.3,65.44 45.43,65.59 45.59,65.72 45.77,65.82 45.96,65.87 46.14,65.89 49.99,65.89 50.16,65.87 50.36,65.82 50.54,65.72 50.69,65.59 50.82,65.44 50.91,65.26 50.97,65.06 50.99,64.89 50.99,60.31 50.97,60.14 50.91,59.94 50.82,59.76 50.69,59.6 50.54,59.48 50.36,59.38 50.16,59.33 49.99,59.31 46.14,59.31 45.96,59.33 45.77,59.38 45.59,59.48 45.43,59.6 45.3,59.76 45.21,59.94 45.15,60.14 45.14,60.31
IBUS+ on Top Layer: 45.11,82.22 45.13,82.4 45.18,82.59 45.28,82.77 45.4,82.93 45.56,83.05 45.74,83.15 45.94,83.2 46.11,83.22 49.81,83.22 49.98,83.2 50.18,83.15 50.36,83.05 50.51,82.93 50.64,82.77 50.74,82.59 50.79,82.4 50.81,82.22 50.81,78.1 50.79,77.93 50.74,77.73 50.64,77.55 50.51,77.4 50.36,77.27 50.18,77.17 49.98,77.12 49.81,77.1 46.11,77.1 45.94,77.12 45.74,77.17 45.56,77.27 45.4,77.4 45.28,77.55 45.18,77.73 45.13,77.93 45.11,78.1
IBUS+ on Top Layer: 44.86,47.23 44.87,47.34 44.92,47.47 45,47.58 45.12,47.67 45.25,47.72 45.36,47.73 50.46,47.73 50.56,47.72 50.7,47.67 50.81,47.58 50.9,47.47 50.95,47.34 50.96,47.23 50.96,40.34 50.95,40.23 50.9,40.1 50.81,39.98 50.7,39.9 50.56,39.85 50.46,39.84 45.36,39.84 45.25,39.85 45.12,39.9 45,39.98 44.92,40.1 44.87,40.23 44.86,40.34
IBUS+ on Bottom Layer: 45.07,21.86 44.9,21.71 44.67,21.66 30.45,21.66 30.09,21.81 29.95,22.16 29.95,26.44 30.09,26.79 30.45,26.94 42.7,26.94 45.09,29.32 45.09,81.85 45.38,82.55 46.09,82.85 50.02,82.85 50.73,82.55 51.02,81.85 51.02,28.17 50.94,27.77 50.69,27.43 50.65,27.25 50.55,27.09 45.46,22 45.3,21.89 45.11,21.86
IU+ on Top Layer: 33.15,82.37 40.59,82.37 40.59,70.27 33.15,70.27
IV+ on Top Layer: 32.99,64.09 40.43,64.09 40.43,52.66 32.99,52.66
IW+ on Top Layer: 33.06,45.86 40.5,45.86 40.5,36.86 33.06,36.86
SWCLK on Top Layer: 53.39,98.08 55.78,98.08 55.78,95.54 53.39,95.54
SWCLK on Bottom Layer: 53.39,98.08 55.78,98.08 55.78,95.54 53.39,95.54
SWDIO on Top Layer: 56.01,98.08 58.4,98.08 58.4,95.54 56.01,95.54
SWDIO on Bottom Layer: 56.01,98.08 58.4,98.08 58.4,95.54 56.01,95.54
U on Top Layer: 17.34,82.61 17.36,82.79 17.41,82.99 17.51,83.17 17.63,83.32 17.79,83.45 17.97,83.54 18.17,83.6 18.34,83.61 30.83,83.61 31,83.6 31.2,83.54 31.38,83.45 31.54,83.32 31.66,83.17 31.76,82.99 31.81,82.79 31.83,82.61 31.83,72.43 31.81,72.25 31.76,72.06 31.66,71.88 31.54,71.72 31.38,71.59 31.2,71.5 31,71.44 30.83,71.43 18.34,71.43 18.17,71.44 17.97,71.5 17.79,71.59 17.63,71.72 17.51,71.88 17.41,72.06 17.36,72.25 17.34,72.43
U on Top Layer: 21.59,85.79 21.61,85.97 21.66,86.16 21.76,86.34 21.88,86.5 22.04,86.63 22.22,86.72 22.41,86.78 22.59,86.79 30.85,86.79 31.03,86.78 31.22,86.72 31.4,86.63 31.56,86.5 31.68,86.34 31.78,86.16 31.83,85.97 31.85,85.79 31.85,83.61 31.83,83.43 31.78,83.24 31.68,83.06 31.56,82.9 31.4,82.78 31.22,82.68 31.03,82.63 30.85,82.61 22.59,82.61 22.41,82.63 22.22,82.68 22.04,82.78 21.88,82.9 21.76,83.06 21.66,83.24 21.61,83.43 21.59,83.61
U on Top Layer: 21.03,96.1 21.05,96.28 21.1,96.47 21.2,96.65 21.32,96.81 21.48,96.94 21.66,97.03 21.86,97.08 22.03,97.1 25.2,97.1 25.38,97.08 25.57,97.03 25.75,96.94 25.91,96.81 26.04,96.65 26.13,96.47 26.19,96.28 26.2,96.1 26.2,93.05 26.19,92.87 26.13,92.68 26.04,92.5 25.91,92.34 25.75,92.22 25.57,92.12 25.38,92.07 25.2,92.05 22.03,92.05 21.86,92.07 21.66,92.12 21.48,92.22 21.32,92.34 21.2,92.5 21.1,92.68 21.05,92.87 21.03,93.05
U on Bottom Layer: 21.04,96.1 21.06,96.28 21.12,96.47 21.21,96.65 21.34,96.81 21.49,96.94 21.67,97.03 21.87,97.09 22.04,97.1 25.04,97.1 25.22,97.09 25.41,97.03 25.59,96.94 25.75,96.81 25.88,96.65 25.97,96.47 26.03,96.28 26.04,96.1 26.04,74.1 26.03,73.92 25.97,73.73 25.88,73.55 25.75,73.39 25.59,73.26 25.41,73.17 25.22,73.11 25.04,73.1 22.04,73.1 21.87,73.11 21.67,73.17 21.49,73.26 21.34,73.39 21.21,73.55 21.12,73.73 21.06,73.92 21.04,74.1
U on Bottom Layer: 11.46,82.5 11.47,82.67 11.53,82.87 11.62,83.05 11.75,83.21 11.91,83.33 12.09,83.43 12.28,83.48 12.46,83.5 24.64,83.5 24.82,83.48 25.01,83.43 25.19,83.33 25.35,83.21 25.48,83.05 25.57,82.87 25.63,82.67 25.64,82.5 25.64,74.19 25.63,74.01 25.57,73.82 25.48,73.64 25.35,73.48 25.19,73.35 25.01,73.26 24.82,73.21 24.64,73.19 12.46,73.19 12.28,73.21 12.09,73.26 11.91,73.35 11.75,73.48 11.62,73.64 11.53,73.82 11.47,74.01 11.46,74.19
V on Top Layer: 17.26,64.43 17.28,64.61 17.33,64.8 17.43,64.98 17.55,65.14 17.71,65.27 17.89,65.36 18.09,65.42 18.26,65.43 30.75,65.43 30.92,65.42 31.12,65.36 31.3,65.27 31.46,65.14 31.58,64.98 31.68,64.8 31.73,64.61 31.75,64.43 31.75,54.3 31.73,54.12 31.68,53.93 31.58,53.75 31.46,53.59 31.3,53.46 31.12,53.37 30.92,53.31 30.75,53.3 18.26,53.3 18.09,53.31 17.89,53.37 17.71,53.46 17.55,53.59 17.43,53.75 17.33,53.93 17.28,54.12 17.26,54.3
V on Top Layer: 27.03,96.04 27.05,96.21 27.1,96.41 27.2,96.59 27.32,96.74 27.48,96.87 27.66,96.97 27.86,97.02 28.03,97.04 31.2,97.04 31.38,97.02 31.57,96.97 31.75,96.87 31.91,96.74 32.04,96.59 32.13,96.41 32.19,96.21 32.2,96.04 32.2,92.99 32.19,92.81 32.13,92.62 32.04,92.44 31.91,92.28 31.75,92.15 31.57,92.06 31.38,92 31.2,91.99 28.03,91.99 27.86,92 27.66,92.06 27.48,92.15 27.32,92.28 27.2,92.44 27.1,92.62 27.05,92.81 27.03,92.99
V on Top Layer: 21.49,67.2 21.5,67.38 21.56,67.57 21.65,67.75 21.78,67.91 21.94,68.03 22.12,68.13 22.31,68.18 22.49,68.2 30.75,68.2 30.92,68.18 31.12,68.13 31.3,68.03 31.46,67.91 31.58,67.75 31.68,67.57 31.73,67.38 31.75,67.2 31.75,65.02 31.73,64.84 31.68,64.65 31.58,64.47 31.46,64.31 31.3,64.18 31.12,64.09 30.92,64.03 30.75,64.02 22.49,64.02 22.31,64.03 22.12,64.09 21.94,64.18 21.78,64.31 21.65,64.47 21.56,64.65 21.5,64.84 21.49,65.02
V on Bottom Layer: 27.04,96.1 27.06,96.28 27.12,96.47 27.21,96.65 27.34,96.81 27.49,96.94 27.67,97.03 27.87,97.09 28.04,97.1 31.04,97.1 31.22,97.09 31.41,97.03 31.59,96.94 31.75,96.81 31.88,96.65 31.97,96.47 32.03,96.28 32.04,96.1 32.04,56.03 32.03,55.85 31.97,55.66 31.88,55.48 31.75,55.32 31.59,55.19 31.41,55.1 31.22,55.04 31.04,55.03 28.04,55.03 27.87,55.04 27.67,55.1 27.49,55.19 27.34,55.32 27.21,55.48 27.12,55.66 27.06,55.85 27.04,56.03
V on Bottom Layer: 11.93,64.37 11.95,64.55 12,64.74 12.1,64.92 12.22,65.08 12.38,65.21 12.56,65.3 12.76,65.35 12.93,65.37 28.24,65.37 28.41,65.35 28.61,65.3 28.79,65.21 28.94,65.08 29.07,64.92 29.16,64.74 29.22,64.55 29.24,64.37 29.24,56.01 29.22,55.83 29.16,55.64 29.07,55.46 28.94,55.3 28.79,55.17 28.61,55.08 28.41,55.02 28.24,55.01 12.93,55.01 12.76,55.02 12.56,55.08 12.38,55.17 12.22,55.3 12.1,55.46 12,55.64 11.95,55.83 11.93,56.01
W on Top Layer: 17.26,46.24 17.28,46.41 17.33,46.61 17.43,46.79 17.55,46.95 17.71,47.07 17.89,47.17 18.09,47.22 18.26,47.24 30.75,47.24 30.92,47.22 31.12,47.17 31.3,47.07 31.46,46.95 31.58,46.79 31.68,46.61 31.73,46.41 31.75,46.24 31.75,37.12 31.73,36.94 31.68,36.75 31.58,36.57 31.46,36.41 31.3,36.28 31.12,36.19 30.92,36.13 30.75,36.12 18.26,36.12 18.09,36.13 17.89,36.19 17.71,36.28 17.55,36.41 17.43,36.57 17.33,36.75 17.28,36.94 17.26,37.12
W on Top Layer: 21.49,49.42 21.5,49.6 21.56,49.79 21.65,49.97 21.78,50.13 21.94,50.25 22.12,50.35 22.31,50.4 22.49,50.42 30.75,50.42 30.92,50.4 31.12,50.35 31.3,50.25 31.46,50.13 31.58,49.97 31.68,49.79 31.73,49.6 31.75,49.42 31.75,47.24 31.73,47.06 31.68,46.87 31.58,46.69 31.46,46.53 31.3,46.4 31.12,46.31 30.92,46.25 30.75,46.24 22.49,46.24 22.31,46.25 22.12,46.31 21.94,46.4 21.78,46.53 21.65,46.69 21.56,46.87 21.5,47.06 21.49,47.24
W on Top Layer: 33.03,95.97 33.05,96.15 33.1,96.34 33.2,96.52 33.32,96.68 33.48,96.81 33.66,96.9 33.86,96.96 34.03,96.97 37.2,96.97 37.38,96.96 37.57,96.9 37.75,96.81 37.91,96.68 38.04,96.52 38.13,96.34 38.19,96.15 38.2,95.97 38.2,92.92 38.19,92.75 38.13,92.55 38.04,92.37 37.91,92.22 37.75,92.09 37.57,91.99 37.38,91.94 37.2,91.92 34.03,91.92 33.86,91.94 33.66,91.99 33.48,92.09 33.32,92.22 33.2,92.37 33.1,92.55 33.05,92.75 33.03,92.92
W on Bottom Layer: 33.04,96.1 33.06,96.28 33.12,96.47 33.21,96.65 33.34,96.81 33.49,96.94 33.67,97.03 33.87,97.09 34.04,97.1 37.04,97.1 37.22,97.09 37.41,97.03 37.59,96.94 37.75,96.81 37.88,96.65 37.97,96.47 38.03,96.28 38.04,96.1 38.04,37.92 38.03,37.74 37.97,37.55 37.88,37.37 37.75,37.21 37.59,37.08 37.41,36.99 37.22,36.93 37.04,36.92 34.04,36.92 33.87,36.93 33.67,36.99 33.49,37.08 33.34,37.21 33.21,37.37 33.12,37.55 33.06,37.74 33.04,37.92
W on Bottom Layer: 12.18,46.09 12.19,46.27 12.25,46.46 12.34,46.64 12.47,46.8 12.63,46.93 12.81,47.02 13,47.08 13.18,47.09 36.94,47.09 37.11,47.08 37.31,47.02 37.49,46.93 37.64,46.8 37.77,46.64 37.86,46.46 37.92,46.27 37.94,46.09 37.94,37.97 37.92,37.8 37.86,37.6 37.77,37.42 37.64,37.27 37.49,37.14 37.31,37.05 37.11,36.99 36.94,36.97 13.18,36.97 13,36.99 12.81,37.05 12.63,37.14 12.47,37.27 12.34,37.42 12.25,37.6 12.19,37.8 12.18,37.97
$1N3251 on Top Layer: 16.83,88.55 16.85,88.63 16.89,88.69 16.96,88.74 17.03,88.75 20.51,88.75 20.59,88.74 20.65,88.69 20.7,88.63 20.71,88.55 20.71,84.6 20.7,84.52 20.65,84.46 20.59,84.41 20.51,84.4 17.03,84.4 16.96,84.41 16.89,84.46 16.85,84.52 16.83,84.6
$1N4479 on Top Layer: 16.88,70.23 16.89,70.31 16.94,70.37 17,70.42 17.08,70.43 20.56,70.43 20.63,70.42 20.7,70.37 20.74,70.31 20.76,70.23 20.76,66.28 20.74,66.2 20.7,66.14 20.63,66.09 20.56,66.08 17.08,66.08 17,66.09 16.94,66.14 16.89,66.2 16.88,66.28
$1N4771 on Top Layer: 17,51.97 17.01,52.05 17.06,52.11 17.12,52.15 17.2,52.17 20.68,52.17 20.75,52.15 20.82,52.11 20.86,52.05 20.88,51.97 20.88,48.02 20.86,47.94 20.82,47.87 20.75,47.83 20.68,47.82 17.2,47.82 17.12,47.83 17.06,47.87 17.01,47.94 17,48.02
$1N52620 on Top Layer: 81.01,77.32 81.01,76.34 81.03,76.33 82.5,76.33 82.63,76.19 83.27,76.19 83.26,76.2 83.26,76.38 82.32,77.32

Small or netless copper shapes (teardrops, artwork), in the pictures only: 1 on Top Layer

## Text on the board
Top Silkscreen Layer: GND | IU | IV | IW | IV_AD | IBUS_AD | IU_AD | IW_AD | 3V3 | LED2_PA12 | LED1_PB5 | POWER | K2_PA6 | RESET | K1_PB3 | SPEED | CLK | DIO | PWMIN | VCC | W | V | U | UVW | YTMR4040_EvalBoard_V1.2 / 24V 15A  360W_2023/10/28
